# Altium project PROC114E3_SCH.PrjPcb (part 2 of 22)

## Sheet 10.SchDoc
size 513 x 386 mm
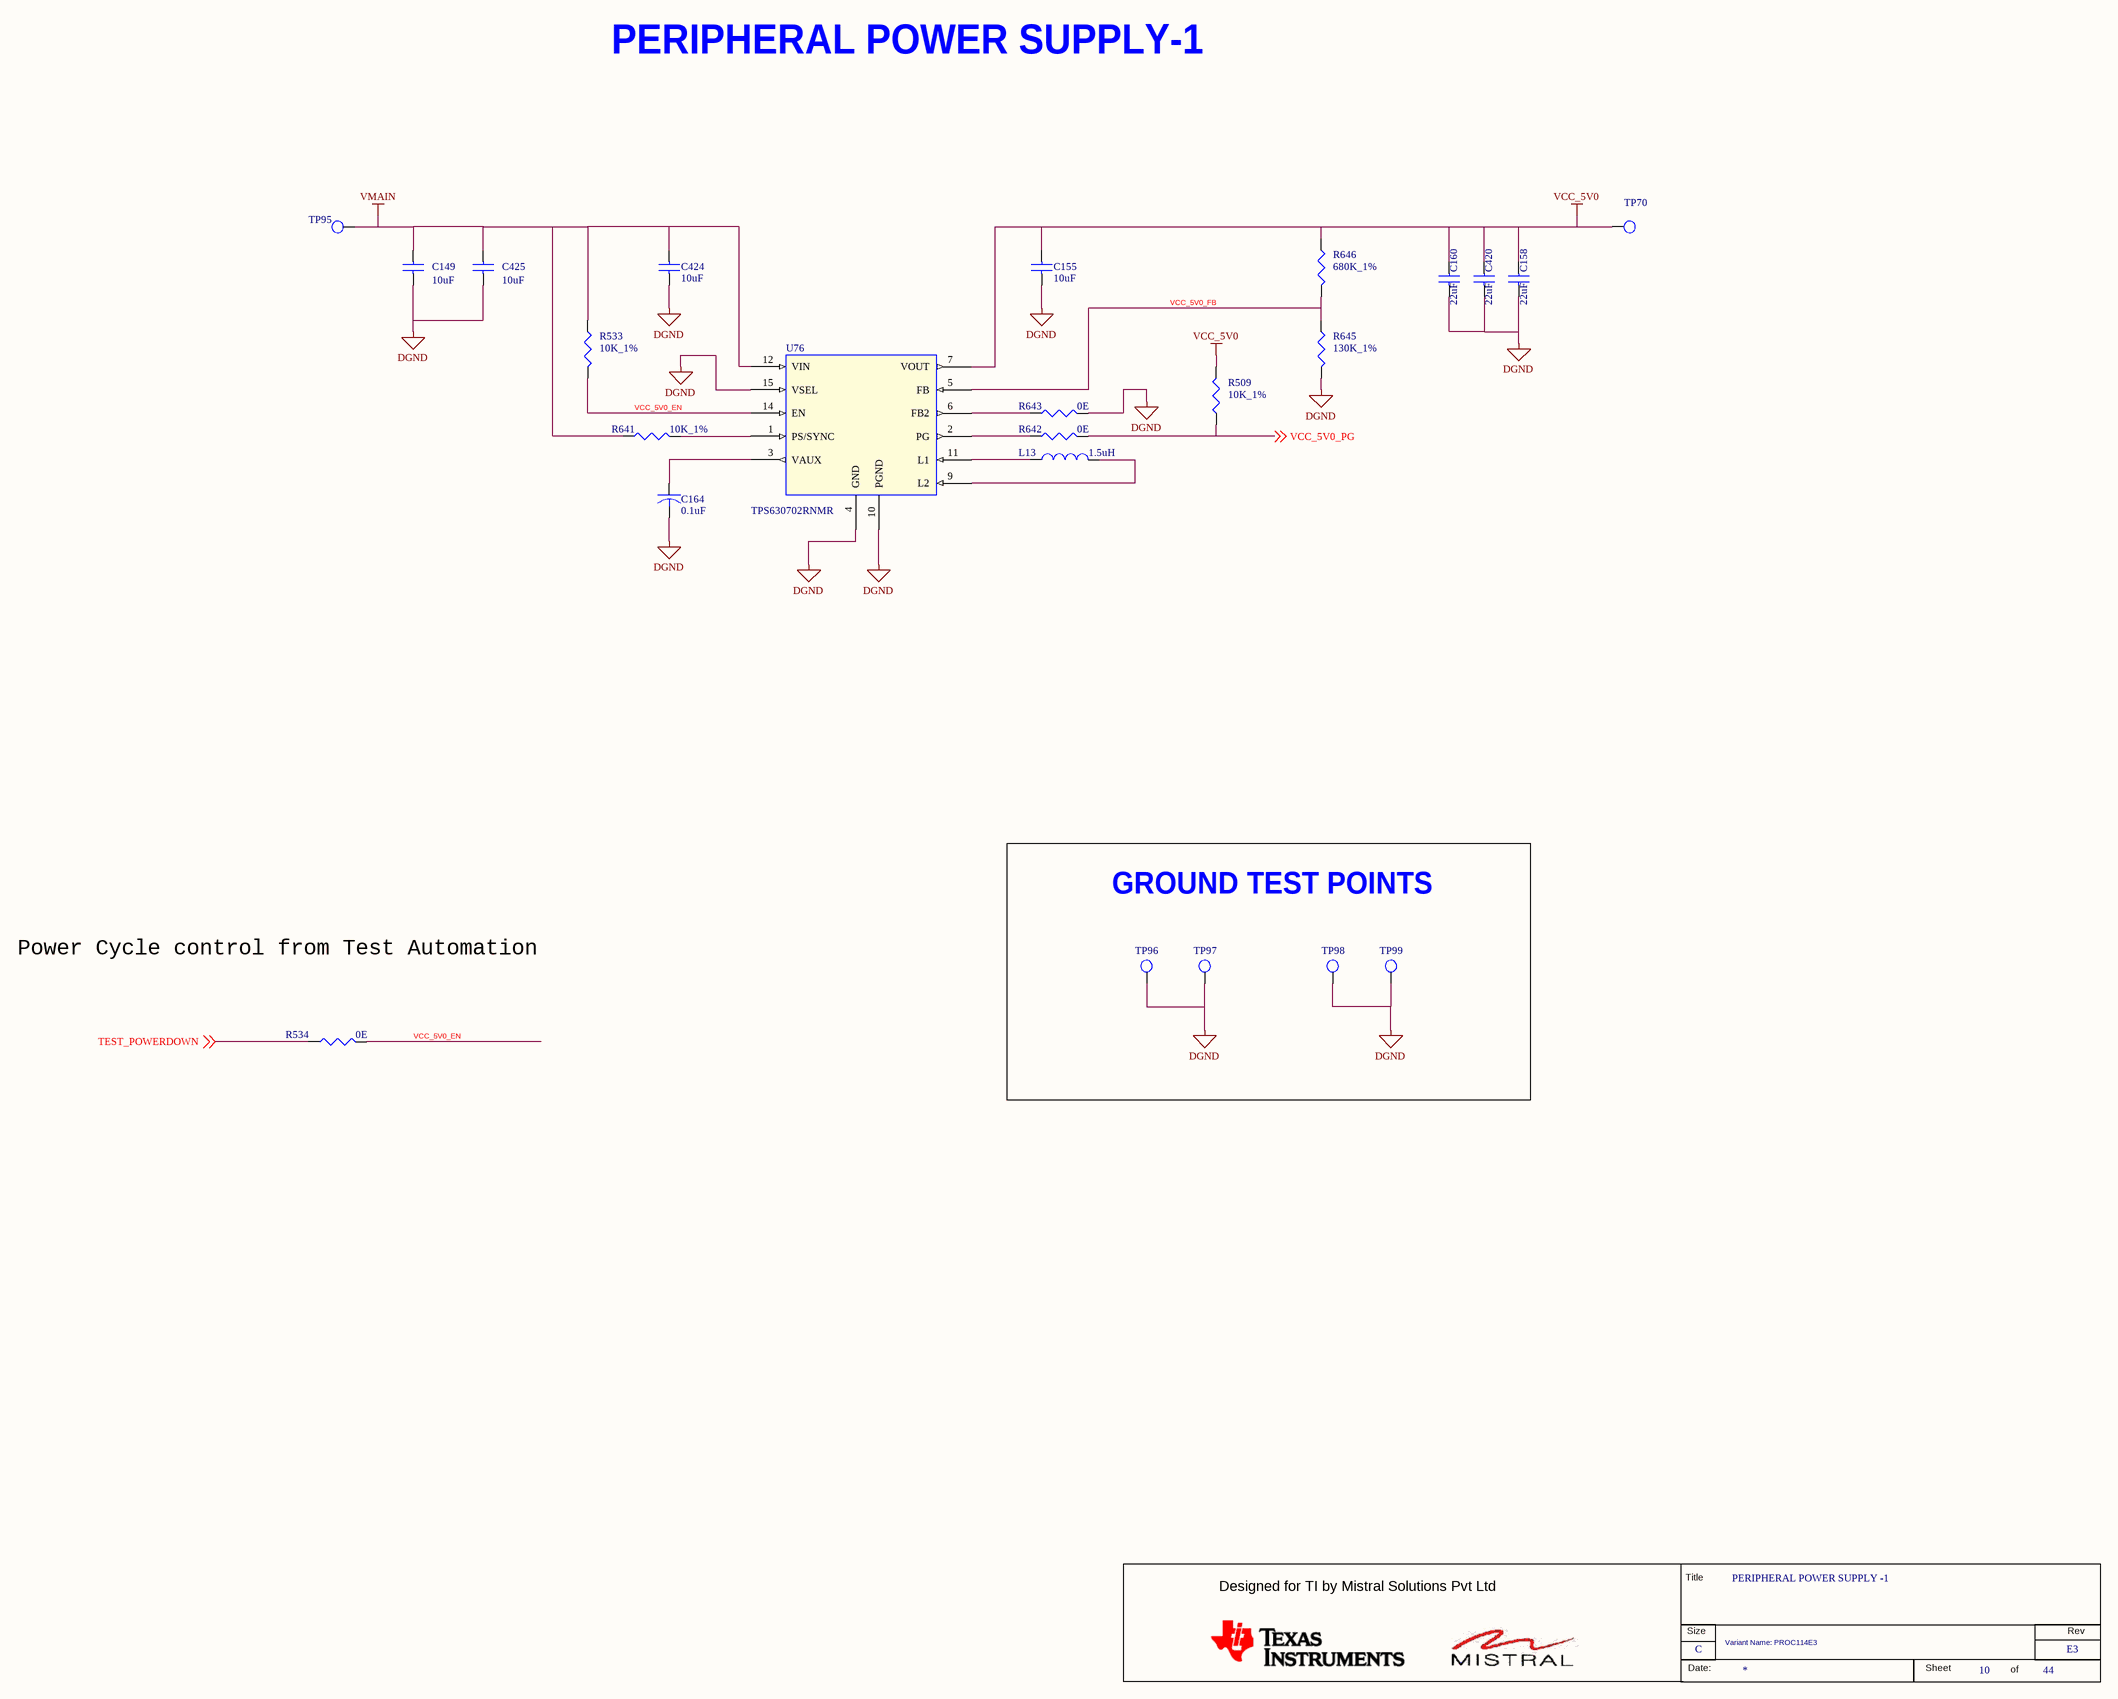
[diagram p10: 10.SchDoc]

### Parts
(Parts that share a designator on the sheet are numbered #1, #2 ... from top to bottom, then left to right.)
*#10  RevCode: E3  Title: PERIPHERAL POWER SUPPLY -1  Page Size: C  Page Number: 10  Page Count: 44  Variant Name: PROC114E3  (hidden comment: MISTRAL_TITLEBLK_CSIZE)  (graphical)
C149  10uF  [CAP0805_1-5]
C155  10uF  [CAP0603_1]
C158  22uF  [CAP0805_1-5]
C160  22uF  [CAP0805_1-5]
C164  0.1uF  [CAP0402_0-75]
C420  22uF  [CAP0805_1-5]
C424  10uF  [CAP0603_1]
C425  10uF  [CAP0805_1-5]
L13  1.5uH  [IND_XFL4020_170X170_SMD_2-1]
R509  10K_1%  [RES0201_0-5]
R533  10K_1%  [RES0201_0-5]
R534  0E  [RES0201_0-5]
R641  10K_1%  [RES0201_0-5]
R642  0E  [RES0201_0-5]
R643  0E  [RES0201_0-5]
R645  130K_1%  [RES0402_0-5]
R646  680K_1%  [RES0402_0-5]
TP70  TP20_SMD  [TP20_SMD]  (value not drawn)
TP95  TP20_SMD  [TP20_SMD]  (value not drawn)
TP96  THRU HOLE  [TP_36X22]  (value not drawn)
TP97  THRU HOLE  [TP_36X22]  (value not drawn)
TP98  TP20_SMD  [TP20_SMD]  (value not drawn)
TP99  TP20_SMD  [TP20_SMD]  (value not drawn)
U76  TPS630702RNMR  [VQFNHR15_TPS630701_100X120_1]

### Blocks framed on the sheet
GROUND TEST POINTS: TP96-TP99

### Nets
DGND: C149.2 C155.2 C158.2 C160.2 C164.2 C420.2 C424.2 C425.2 R643.2 R645.2 TP96.1(TP) TP97.1(TP) TP98.1(TP) TP99.1(TP) U76.4(GND) U76.10(PGND) U76.15(VSEL)
VCC_5V0: C155.1 C158.1 C160.1 C420.1 R509.2 R646.1 TP70.1(TP) U76.7(VOUT)
VMAIN: C149.1 C424.1 C425.1 R533.1 R641.1 TP95.1(TP) U76.12(VIN)
TEST_POWERDOWN: R534.1 ; off-sheet TEST_POWERDOWN
VCC_5V0_EN: R533.2 R534.2 U76.14(EN)
VCC_5V0_FB: R645.1 R646.2 U76.5(FB)
VCC_5V0_PG: R509.1 R642.2 ; off-sheet VCC_5V0_PG
NetC164_1: C164.1 U76.3(VAUX)
NetL13_1: L13.1 U76.11(L1)
NetL13_2: L13.2 U76.9(L2)
NetR641_2: R641.2 U76.1(PS/SYNC)
NetR642_1: R642.1 U76.2(PG)
NetR643_1: R643.1 U76.6(FB2)

### Notes on the sheet
- PERIPHERAL POWER SUPPLY-1
- Power Cycle control from Test Automation
- (in symbol MISTRAL_TITLEBLK_CSIZE) Title; Designed for TI by Mistral Solutions Pvt Ltd; Size; Rev; Date:; Sheet; of

### Library data of the parts
*#10 = MISTRAL_TITLEBLK_CSIZE: Issue: 1.0; Page Create Date: March  8, 1995; Page Modify Date: *; Schematic Page Count: 44; Schematic Page Number: 10
C149 = CAP_Dup2: CAP CERAMIC 10uF 50V 10% X5R 0805; Mistral Part No: 120021030002-R; Mfr_name: MURATA; Mfr_part_number: GRM21BR61H106KE43L; Part_type: CAPACITORS\CERAMIC; Project: J7ES_SK_BRD; Wattage: NA; Customs_HS_Code: 85322990; Custom_Duty: 15%; Footprint Ref: CAP0805_1-5; Tolerance: 10%; Voltage: 50V; Package: 0805; Distributor_name: DIGIKEY; Distributor_part_number: 490-18663-1-ND; Library Ref: CAP; Height: 1.45MM; Weight: 6.4mg; Temperature: -55°C+85°C; Datasheet: Y:\MIS_DATABASE\DATASHEETS\CAPACITORS\GRM21BR61H106KE43.PDF; Crtd /date: ALVY/010321; Chkd/date: MANIRAJA/010321; MECHANICAL 3D STEP FILE: CAP0805_1-5; Library Path: Y:\MIS_DATABASE\Library\ALTIUM_TOOL\SCHEMATICS_PARTS\MS_DISCRETE_Library.schlib; Footprint Path: Y:\MIS_DATABASE\Library\ALTIUM_TOOL\PCB_FOOTPRINTS\Altium_Footprint_Lib.PcbLib; PCB Footprint: CAP0805_1-5
C155 = CAP_Dup2: as C150 on sheet 09; Footprint Ref: CAP0603_1; Tolerance: 20%; Voltage: 35V; Package: 0603; Distributor_name: DIGIKEY; Distributor_part_number: 490-13248-1-ND; Library Ref: CAP; Height: 1.00MM; Weight: 9mg; Temperature: -55°C+85°C; Datasheet: Y:\MIS_DATABASE\DATASHEETS\CAPACITORS\GRM188R6YA106MA73.PDF; Crtd /date: ALVY/160519; Chkd/date: MANIRAJA/170519; MECHANICAL 3D STEP FILE: CAP0603_1; Library Path: Y:\MIS_DATABASE\Library\ALTIUM_TOOL\SCHEMATICS_PARTS\MS_DISCRETE_Library.schlib; Footprint Path: Y:\MIS_DATABASE\Library\ALTIUM_TOOL\PCB_FOOTPRINTS\Altium_Footprint_Lib.PcbLib; PCB Footprint: CAP0603_1
C158 C160 = CAP_Dup2: CAP CERAMIC 22uF 25V 20% X5R 0805; Part_type: CAPACITORS\CERAMIC; Mfr_part_number: GRM21BR61E226ME44K; Mfr_name: MURATA; Mistral Part No: 120013120018-R; Custom_Duty: 15%; Customs_HS_Code: 85322990; Wattage: NA; Project: TI_J7SVB_PCIE_ADD-ON-CARD; PCB Footprint: CAP0805_1-5; Footprint Path: Y:\MIS_DATABASE\Library\ALTIUM_TOOL\PCB_FOOTPRINTS\Altium_Footprint_Lib.PcbLib; Library Path: Y:\MIS_DATABASE\Library\ALTIUM_TOOL\SCHEMATICS_PARTS\MS_DISCRETE_Library.schlib; MECHANICAL 3D STEP FILE: CAP0805_1-5; Chkd/date: MANIRAJA/110718; Crtd /date: ALVY/110718; Datasheet: Y:\MIS_DATABASE\DATASHEETS\CAPACITORS\GRM21BR61E226ME44K.PDF; Temperature: -55°C+85°C; Weight: 9.5mg; Height: 1.45MM; Library Ref: CAP; Distributor_part_number: 490-14661-1-ND; Distributor_name: DIGIKEY; Package: 0805; Voltage: 25V; Tolerance: 20%; Footprint Ref: CAP0805_1-5
C164 = CAP_Dup1: CAP CERAMIC 0.1uF 50V 10% X7R 0402; Part_type: CAPACITORS\CERAMIC; Mfr_part_number: GRM155R71H104KE14D; Mfr_name: MURATA; Mistral Part No: 120011100014-R; Custom_Duty: 15%; Customs_HS_Code: 85322990; Wattage: NA; Project: J7_CP; Footprint Path: Y:\MIS_DATABASE\Library\ALTIUM_TOOL\PCB_FOOTPRINTS\Altium_Footprint_Lib.PcbLib; Library Path: Y:\MIS_DATABASE\Library\ALTIUM_TOOL\SCHEMATICS_PARTS\MS_DISCRETE_Library.schlib; MECHANICAL 3D STEP FILE: CAP0402_0-75; Chkd/date: MANIRAJA/261020; Crtd /date: ALVY/211020; Datasheet: Y:\MIS_DATABASE\DATASHEETS\CAPACITORS\GRM155R71H104KE14.PDF; Temperature: -55°C+125°C; Weight: 3.1mg; Height: 0.55MM; Library Ref: CAP; Distributor_part_number: 490-10700-1-ND; Distributor_name: DIGIKEY; Package: 0402; Voltage: 50V; Tolerance: 10%; Footprint Ref: CAP0402_0-75; PCB Footprint: CAP0402_0-75
C420 = CAP_Dup2: CAP CERAMIC 22uF 25V 20% X5R 0805; Mistral Part No: 120013120018-R; Mfr_name: MURATA; Mfr_part_number: GRM21BR61E226ME44K; Part_type: CAPACITORS\CERAMIC; Project: TI_J7SVB_PCIE_ADD-ON-CARD; Wattage: NA; Customs_HS_Code: 85322990; Custom_Duty: 15%; PCB Footprint: CAP0805_1-5; Footprint Ref: CAP0805_1-5; Tolerance: 20%; Voltage: 25V; Package: 0805; Distributor_name: DIGIKEY; Distributor_part_number: 490-14661-1-ND; Library Ref: CAP; Height: 1.45MM; Weight: 9.5mg; Temperature: -55°C+85°C; Datasheet: Y:\MIS_DATABASE\DATASHEETS\CAPACITORS\GRM21BR61E226ME44K.PDF; Crtd /date: ALVY/110718; Chkd/date: MANIRAJA/110718; MECHANICAL 3D STEP FILE: CAP0805_1-5; Library Path: Y:\MIS_DATABASE\Library\ALTIUM_TOOL\SCHEMATICS_PARTS\MS_DISCRETE_Library.schlib; Footprint Path: Y:\MIS_DATABASE\Library\ALTIUM_TOOL\PCB_FOOTPRINTS\Altium_Footprint_Lib.PcbLib
C424 = CAP_Dup2: as C141 on sheet 09; Footprint Path: Y:\MIS_DATABASE\Library\ALTIUM_TOOL\PCB_FOOTPRINTS\Altium_Footprint_Lib.PcbLib; Library Path: Y:\MIS_DATABASE\Library\ALTIUM_TOOL\SCHEMATICS_PARTS\MS_DISCRETE_Library.schlib; MECHANICAL 3D STEP FILE: CAP0603_1; Chkd/date: MANIRAJA/170519; Crtd /date: ALVY/160519; Datasheet: Y:\MIS_DATABASE\DATASHEETS\CAPACITORS\GRM188R6YA106MA73.PDF; Temperature: -55°C+85°C; Weight: 9mg; Height: 1.00MM; Library Ref: CAP; Distributor_part_number: 490-13248-1-ND; Distributor_name: DIGIKEY; Package: 0603; Voltage: 35V; Tolerance: 20%; Footprint Ref: CAP0603_1; PCB Footprint: CAP0603_1
C425 = CAP_Dup2: CAP CERAMIC 10uF 50V 10% X5R 0805; Part_type: CAPACITORS\CERAMIC; Mfr_part_number: GRM21BR61H106KE43L; Mfr_name: MURATA; Mistral Part No: 120021030002-R; Custom_Duty: 15%; Customs_HS_Code: 85322990; Wattage: NA; Project: J7ES_SK_BRD; Footprint Path: Y:\MIS_DATABASE\Library\ALTIUM_TOOL\PCB_FOOTPRINTS\Altium_Footprint_Lib.PcbLib; Library Path: Y:\MIS_DATABASE\Library\ALTIUM_TOOL\SCHEMATICS_PARTS\MS_DISCRETE_Library.schlib; MECHANICAL 3D STEP FILE: CAP0805_1-5; Chkd/date: MANIRAJA/010321; Crtd /date: ALVY/010321; Datasheet: Y:\MIS_DATABASE\DATASHEETS\CAPACITORS\GRM21BR61H106KE43.PDF; Temperature: -55°C+85°C; Weight: 6.4mg; Height: 1.45MM; Library Ref: CAP; Distributor_part_number: 490-18663-1-ND; Distributor_name: DIGIKEY; Package: 0805; Voltage: 50V; Tolerance: 10%; Footprint Ref: CAP0805_1-5; PCB Footprint: CAP0805_1-5
L13 = INDUCTOR_Dup1: IND POWER 1.5uH 9.1A 20% SMD; Mistral Part No: 130019100011-R; Mfr_name: COIL CRAFT; Mfr_part_number: XFL4020-152MEB; Project: NPOL_UAIS_CONTROLLER-CARD; Voltage: NA; Customs_HS_Code: 85437099; Custom_Duty: 24%; Footprint Ref: IND_XFL4020_170X170_SMD_2-1; Part_type: INDUCTOR; Tolerance: 20%; Wattage: NA; Package: SMD; Distributor_name: MOUSER; Distributor_part_number: 994-XFL4020-152MEB; Library Ref: INDUCTOR; Height: 2.10MM; Weight: 169mg; Temperature: -40°C+125°C; Datasheet: Y:\MIS_DATABASE\DATASHEETS\DISCRETES\INDUCTORS\XFL4020.PDF; Crtd /date: MANIRAJA/101019; Chkd/date: MANIRAJA/101019; MECHANICAL 3D STEP FILE: IND_XFL4020_170X170_SMD_2-1; Library Path: Y:\MIS_DATABASE\Library\ALTIUM_TOOL\SCHEMATICS_PARTS\MS_DISCRETE_Library.schlib; Footprint Path: Y:\MIS_DATABASE\Library\ALTIUM_TOOL\PCB_FOOTPRINTS\Altium_Footprint_Lib.PcbLib; PCB Footprint: IND_XFL4020_170X170_SMD_2-1
R509 R533 R641 = RESISTOR_Dup6: as R470 on sheet 09; PCB Footprint: RES0201_0-5; Footprint Ref: RES0201_0-5; Tolerance: 1%; Wattage: 1/20W; Package: 0201; Distributor_name: DIGIKEY; Distributor_part_number: 311-10.0KMCT-ND; Library Ref: RESISTOR; Height: 0.26MM; Weight: 0.17mg; Temperature: -55°C+125°C; Datasheet: Y:\MIS_DATABASE\DATASHEETS\RESISTORS\RCXXXXL-SER_MAR18.PDF; Crtd /date: MANIRAJA/270117; Chkd/date: VASANTHA/270117; MECHANICAL 3D STEP FILE: RES0201_0-5; Library Path: Y:\MIS_DATABASE\Library\ALTIUM_TOOL\SCHEMATICS_PARTS\MS_DISCRETE_Library.schlib; Footprint Path: Y:\MIS_DATABASE\Library\ALTIUM_TOOL\PCB_FOOTPRINTS\Altium_Footprint_Lib.PcbLib
R534 R642 = RESISTOR_Dup6: as R157 on sheet 09; PCB Footprint: RES0201_0-5; Footprint Path: Y:\MIS_DATABASE\Library\ALTIUM_TOOL\PCB_FOOTPRINTS\Altium_Footprint_Lib.PcbLib; Library Path: Y:\MIS_DATABASE\Library\ALTIUM_TOOL\SCHEMATICS_PARTS\MS_DISCRETE_Library.schlib; MECHANICAL 3D STEP FILE: RES0201_0-5; Chkd/date: NAVEED/301214; Crtd /date: MUDDU/120710; Datasheet: Y:\MIS_DATABASE\DATASHEETS\RESISTORS\RCXXXXL-SER_MAR18.PDF; Temperature: -55°C+125°C; Weight: 0.17mg; Height: 0.26MM; Library Ref: RESISTOR; Distributor_part_number: 311-0.0NCT-ND; Distributor_name: DIGIKEY; Package: 0201; Wattage: 1/20W; Tolerance: 5%; Footprint Ref: RES0201_0-5
R643 = RESISTOR_Dup6: as R468 on sheet 09; PCB Footprint: RES0201_0-5; Footprint Ref: RES0201_0-5; Tolerance: 5%; Wattage: 1/20W; Package: 0201; Distributor_name: DIGIKEY; Distributor_part_number: 311-0.0NCT-ND; Library Ref: RESISTOR; Height: 0.26MM; Weight: 0.17mg; Temperature: -55°C+125°C; Datasheet: Y:\MIS_DATABASE\DATASHEETS\RESISTORS\RCXXXXL-SER_MAR18.PDF; Crtd /date: MUDDU/120710; Chkd/date: NAVEED/301214; MECHANICAL 3D STEP FILE: RES0201_0-5; Library Path: Y:\MIS_DATABASE\Library\ALTIUM_TOOL\SCHEMATICS_PARTS\MS_DISCRETE_Library.schlib; Footprint Path: Y:\MIS_DATABASE\Library\ALTIUM_TOOL\PCB_FOOTPRINTS\Altium_Footprint_Lib.PcbLib
R645 = RESISTOR_Dup6: RES 130K 1/10W 1% 0402; Part_type: RESISTORS\FIXED; Mfr_part_number: ERJ-2RKF1303X; Mfr_name: PANASONIC-ECG; Mistral Part No: 110011060012-R; Custom_Duty: 15%; Customs_HS_Code: 85332119; Voltage: NA; Project: AM4515_EVM_LCD; PCB Footprint: RES0402_0-5; Footprint Path: Y:\MIS_DATABASE\Library\ALTIUM_TOOL\PCB_FOOTPRINTS\Altium_Footprint_Lib.PcbLib; Library Path: Y:\MIS_DATABASE\Library\ALTIUM_TOOL\SCHEMATICS_PARTS\MS_DISCRETE_Library.schlib; MECHANICAL 3D STEP FILE: RES0402_0-5; Chkd/date: MAZHAR/150611; Crtd /date: BAVISH/020611; Datasheet: Y:\MIS_DATABASE\DATASHEETS\RESISTORS\PAN-ERJSER_NOV17.PDF; Temperature: -55°C+155°C; Weight: 0.8mg; Height: 0.40MM; Library Ref: RESISTOR; Distributor_part_number: P130KLCT-ND; Distributor_name: DIGIKEY; Package: 0402; Wattage: 1/10W; Tolerance: 1%; Footprint Ref: RES0402_0-5
R646 = RESISTOR_Dup6: RES 680K 1/10W 1% 0402; Mistral Part No: 110011040004-R; Mfr_name: PANASONIC-ECG; Mfr_part_number: ERJ-2RKF6803X; Part_type: RESISTORS\FIXED; Project: AM4515_EVM_LCD; Voltage: NA; Customs_HS_Code: 85332119; Custom_Duty: 15%; PCB Footprint: RES0402_0-5; Footprint Ref: RES0402_0-5; Tolerance: 1%; Wattage: 1/10W; Package: 0402; Distributor_name: DIGIKEY; Distributor_part_number: P680KLCT-ND; Library Ref: RESISTOR; Height: 0.40MM; Weight: 0.8mg; Temperature: -55°C+155°C; Datasheet: Y:\MIS_DATABASE\DATASHEETS\RESISTORS\PAN-ERJSER_NOV17.PDF; Crtd /date: MAZHAR/180411; Chkd/date: SUHAS/200411; MECHANICAL 3D STEP FILE: RES0402_0-5; Library Path: Y:\MIS_DATABASE\Library\ALTIUM_TOOL\SCHEMATICS_PARTS\MS_DISCRETE_Library.schlib; Footprint Path: Y:\MIS_DATABASE\Library\ALTIUM_TOOL\PCB_FOOTPRINTS\Altium_Footprint_Lib.PcbLib
TP70 TP99 = TESTPOINT: TESTPOINT CIR 20 SMD; Mfr_name: LOCAL; Custom_Duty: NA; Project: BT MODULE_CSRBC04; PCB Footprint: TP20_SMD; Customs_HS_Code: NA; RoHS: NA; Footprint Ref: TP20_SMD; Library Ref: TESTPOINT; Mistral Part No: NA; Mfr_part_number: TP20_SMD; Part_type: TESTPOINT; Package: SMD; Distributor_name: NA; Distributor_part_number: NA; Height: NA; Crtd /date: MAZHAR/171006; Chkd/date: SHREESHAIL/171006; Tolerance: NA; Voltage: NA; Wattage: NA; Weight: NA; Temperature: NA; Datasheet: NA; MECHANICAL 3D STEP FILE: NA; Library Path: Y:\MIS_DATABASE\Library\ALTIUM_TOOL\SCHEMATICS_PARTS\MS_DISCRETE_Library.schlib; Footprint Path: Y:\MIS_DATABASE\Library\ALTIUM_TOOL\PCB_FOOTPRINTS\Altium_Footprint_Lib.PcbLib
TP95 = TESTPOINT: as TP92 on sheet 09; Footprint Path: Y:\MIS_DATABASE\Library\ALTIUM_TOOL\PCB_FOOTPRINTS\Altium_Footprint_Lib.PcbLib; Library Path: Y:\MIS_DATABASE\Library\ALTIUM_TOOL\SCHEMATICS_PARTS\MS_DISCRETE_Library.schlib; Datasheet: NA; Temperature: NA; Weight: NA; Wattage: NA; Voltage: NA; Tolerance: NA; Chkd/date: SHREESHAIL/171006; Crtd /date: MAZHAR/171006; Height: NA; Distributor_part_number: NA; Distributor_name: NA; Package: SMD; Part_type: TESTPOINT; Mfr_part_number: TP20_SMD; Mistral Part No: NA; Library Ref: TESTPOINT; Footprint Ref: TP20_SMD; RoHS: NA; Customs_HS_Code: NA; Custom_Duty: NA; PCB Footprint: TP20_SMD
TP96 = TESTPOINT: TESTPOINT 0.56MM DRILL PTH; Mfr_name: LOCAL; Mistral Part No: 130010010008; Project: KOPIN_MODULS; Tolerance: NA; PCB Footprint: TP_36X22; Library Ref: TESTPOINT; Datasheet: NA; Chkd/date: BAVISH/040311; Crtd /date: MAZHAR/110405; Height: NA; Distributor_part_number: NA; Distributor_name: NA; Package: THRU-HOLE; Part_type: TESTPOINT; Mfr_part_number: TP_36X22; Voltage: NA; Wattage: NA; Weight: NA; Temperature: NA
TP97 = TESTPOINT: TESTPOINT 0.56MM DRILL PTH; Mistral Part No: 130010010008; Mfr_name: LOCAL; Wattage: NA; Project: KOPIN_MODULS; PCB Footprint: TP_36X22; Temperature: NA; Weight: NA; Voltage: NA; Tolerance: NA; Mfr_part_number: TP_36X22; Part_type: TESTPOINT; Package: THRU-HOLE; Distributor_name: NA; Distributor_part_number: NA; Height: NA; Crtd /date: MAZHAR/110405; Chkd/date: BAVISH/040311; Datasheet: NA; Library Ref: TESTPOINT
TP98 = TESTPOINT: TESTPOINT CIR 20 SMD; Mistral Part No: NA; Mfr_name: LOCAL; Project: BT MODULE_CSRBC04; PCB Footprint: TP20_SMD; RoHS: NA; Footprint Ref: TP20_SMD; Library Ref: TESTPOINT; Mfr_part_number: TP20_SMD; Part_type: TESTPOINT; Package: SMD; Distributor_name: NA; Distributor_part_number: NA; Height: NA; Crtd /date: MAZHAR/171006; Chkd/date: SHREESHAIL/171006; Tolerance: NA; Voltage: NA; Wattage: NA; Weight: NA; Temperature: NA; Datasheet: NA; MECHANICAL 3D STEP FILE: NA; Library Path: Y:\MIS_DATABASE\Library\ALTIUM_TOOL\SCHEMATICS_PARTS\MS_DISCRETE_Library.schlib; Footprint Path: Y:\MIS_DATABASE\Library\ALTIUM_TOOL\PCB_FOOTPRINTS\Altium_Footprint_Lib.PcbLib; Customs_HS_Code: NA; Custom_Duty: NA
U76 = TPS630701_VQFN-HR15: IC ADJ BUCK-BOOST CONVERTER WITH 3.6A SWITCH CURRENT VQFN-HR15; Mistral Part No: 142022010015-R; Mfr_name: TEXAS INSTRUMENTS; Part_type: ICS\POWER\DC-DC CONVERTER; Project: AM62X_SKEVM; Tolerance: NA; Customs_HS_Code: 85423100; Custom_Duty: 15%; PCB Footprint: VQFNHR15_TPS630701_100X120_1; Footprint Ref: VQFNHR15_TPS630701_100X120_1; Mfr_part_number: TPS630702RNMR; Voltage: NA; Wattage: NA; Package: VQFN-HR15; Distributor_name: DIGIKEY; Distributor_part_number: 296-TPS630702RNMRCT-ND; Library Ref: TPS630701_VQFN-HR15; Height: 1.00MM; Weight: 17.7mg; Temperature: -40°C+125°C; Datasheet: Y:\MIS_DATABASE\DATASHEETS\ICS\POWER\TPS630701X.PDF; Crtd /date: MANIRAJA/250122; Chkd/date: ALVY/250122; MECHANICAL 3D STEP FILE: VQFNHR15_TPS630701_100X120_1; Library Path: Y:\MIS_DATABASE\Library\ALTIUM_TOOL\SCHEMATICS_PARTS\MS_MISCPOWER_Library.schlib; Footprint Path: Y:\MIS_DATABASE\Library\ALTIUM_TOOL\PCB_FOOTPRINTS\Altium_Footprint_Lib.PcbLib

## Sheet 11.SchDoc
size 513 x 386 mm
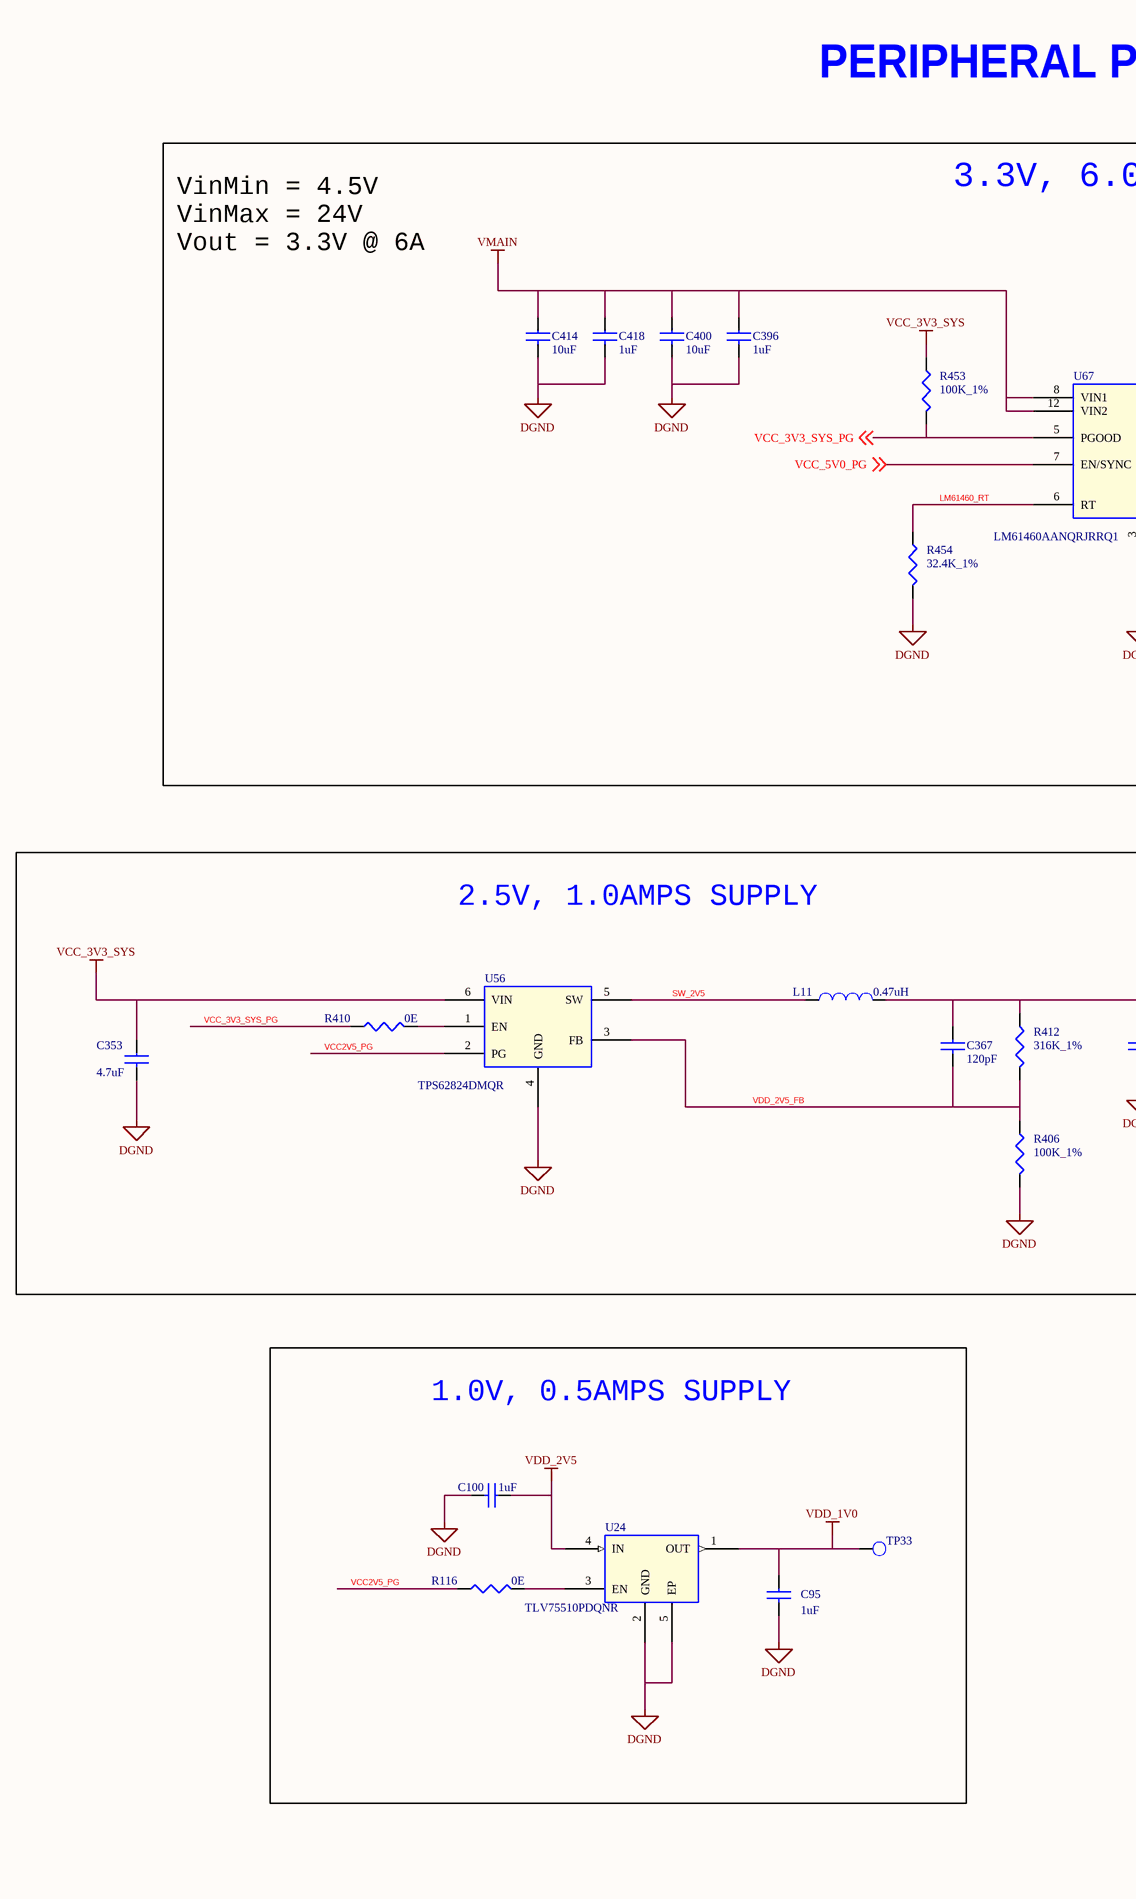
[diagram p11: 11.SchDoc, left]
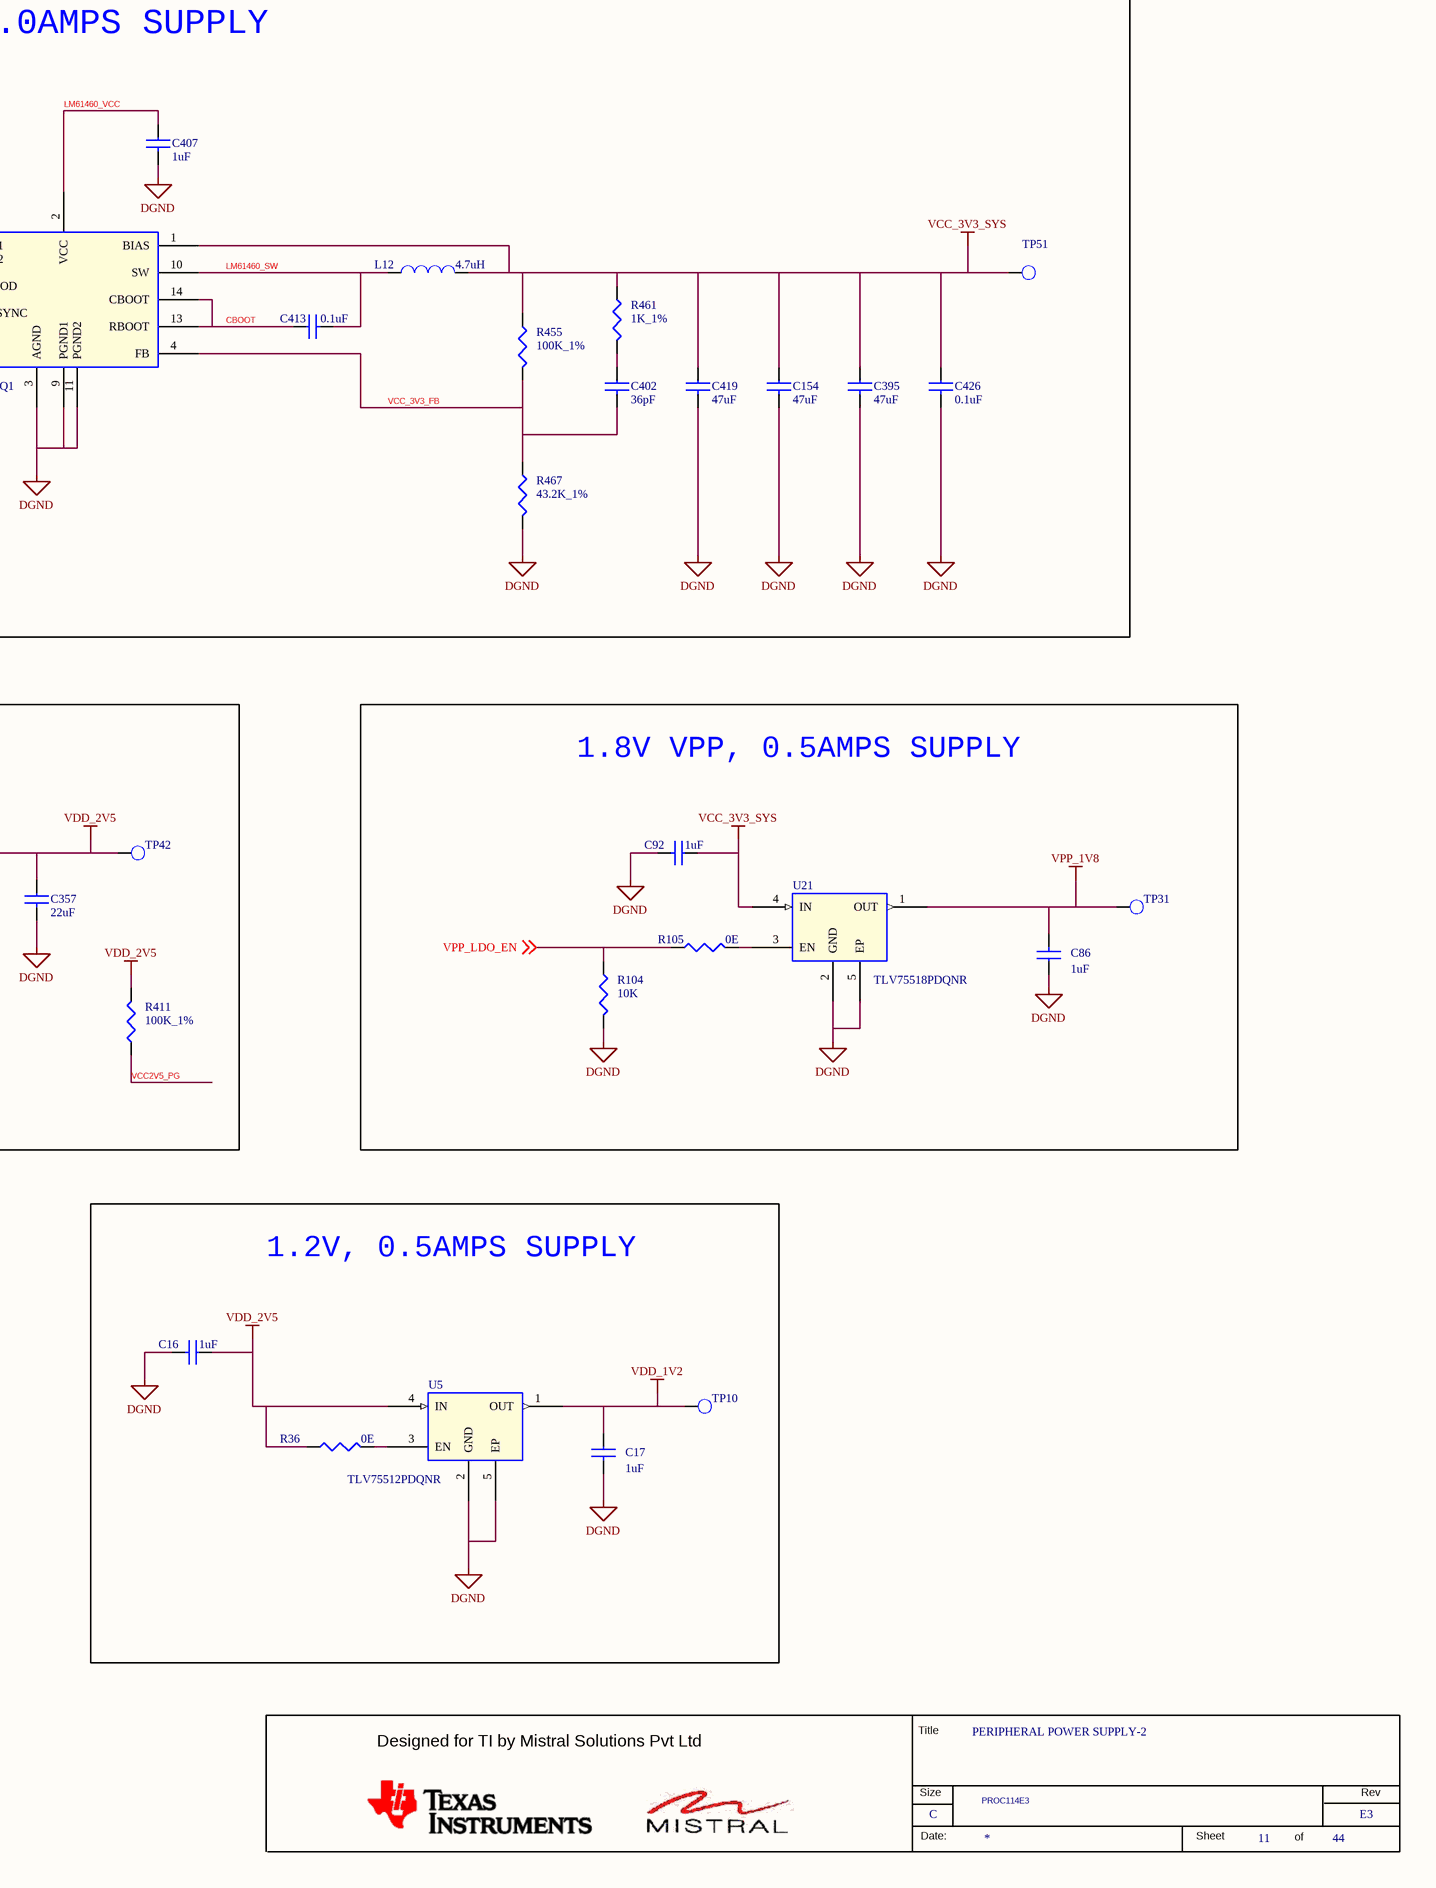
[diagram p12: 11.SchDoc, right]

### Parts
(Parts that share a designator on the sheet are numbered #1, #2 ... from top to bottom, then left to right.)
*#11  RevCode: E3  Title: PERIPHERAL POWER SUPPLY-2  Page Size: C  Page Number: 11  Page Count: 44  Variant Name: PROC114E3  (hidden comment: MISTRAL_TITLEBLK_CSIZE)  (graphical)
C16  1uF  [CAP0201_0-5]
C17  1uF  [CAP0201_0-5]
C86  1uF  [CAP0201_0-5]
C92  1uF  [CAP0201_0-5]
C95  1uF  [CAP0201_0-5]
C100  1uF  [CAP0201_0-5]
C154  47uF  [CAP1210_2-75]
C353  4.7uF  [CAP0603_1]
C357  22uF  [CAP0603_1]
C367  120pF  [CAP0201_0-5]
C395  47uF  [CAP1210_2-75]
C396  1uF  [CAP0805_1-5]
C400  10uF  [CAP0603_1]
C402  36pF  [CAP0402_0-75]
C407  1uF  [CAP0201_0-5]
C413  0.1uF  [CAP0402_0-75]
C414  10uF  [CAP0603_1]
C418  1uF  [CAP0805_1-5]
C419  47uF  [CAP1210_2-75]
C426  0.1uF  [CAP0402_0-75]
L11  0.47uH  [IND0806_1-2]
L12  4.7uH  [IND_XAL6060_260X270_SMD_6-1]
R36  0E  [RES0201_0-5]
R104  10K  [RES0201_0-5]
R105  0E  [RES0201_0-5]
R116  0E  [RES0201_0-5]
R406  100K_1%  [RES0402_0-5]
R410  0E  [RES0201_0-5]
R411  100K_1%  [RES0402_0-5]
R412  316K_1%  [RES0402_0-5]
R453  100K_1%  [RES0402_0-5]
R454  32.4K_1%  [RES0402_0-5]
R455  100K_1%  [RES0402_0-5]
R461  1K_1%  [RES0402_0-5]
R467  43.2K_1%  [RES0402_0-5]
TP10  TP20_SMD  [TP20_SMD]  (value not drawn)
TP31  TP20_SMD  [TP20_SMD]  (value not drawn)
TP33  TP20_SMD  [TP20_SMD]  (value not drawn)
TP42  TP20_SMD  [TP20_SMD]  (value not drawn)
TP51  TP20_SMD  [TP20_SMD]  (value not drawn)
U5  TLV75512PDQNR  [X2SON4_TLV71318P_40X40_0-4]
U21  TLV75518PDQNR  [X2SON4_TLV71318P_40X40_0-4]
U24  TLV75510PDQNR  [X2SON4_TLV71318P_40X40_0-4]
U56  TPS62824DMQR  [VSONHR6_TPS62826_60X60_1]
U67  LM61460AANQRJRRQ1  [VQFNHR14_LM61460_160X140_1]

### Blocks framed on the sheet
3.3V, 6.0AMPS SUPPLY: C154 C395 C396 C400 C402 C407 C413 C414 C418 C419 C426 L12 R453-R455 R461 R467 TP51 U67
2.5V, 1.0AMPS SUPPLY: C353 C357 C367 L11 R406 R410-R412 TP42 U56
1.8V VPP, 0.5AMPS SUPPLY: C86 C92 R104 R105 TP31 U21
1.0V, 0.5AMPS SUPPLY: C95 C100 R116 TP33 U24
1.2V, 0.5AMPS SUPPLY: C16 C17 R36 TP10 U5

### Nets
DGND: C16.2 C17.2 C86.1 C92.2 C95.2 C100.2 C154.2 C353.2 C357.2 C395.2 C396.2 C400.2 C407.2 C414.2 C418.2 C419.2 C426.2 R104.2 R406.2 R454.2 R467.2 U5.2(GND) U5.5(EP) U21.2(GND) U21.5(EP) U24.2(GND) U24.5(EP) U56.4(GND) U67.3(AGND) U67.9(PGND1) U67.11(PGND2)
VCC_3V3_SYS: C92.1 C154.1 C353.1 C395.1 C419.1 C426.1 L12.2 R453.1 R455.1 R461.1 TP51.1(TP) U21.4(IN) U56.6(VIN) U67.1(BIAS)
VDD_1V0: C95.1 TP33.1(TP) U24.1(OUT)
VDD_1V2: C17.1 TP10.1(TP) U5.1(OUT)
VDD_2V5: C16.1 C100.1 C357.1 C367.1 L11.2 R36.1 R411.2 R412.1 TP42.1(TP) U5.4(IN) U24.4(IN)
VMAIN: C396.1 C400.1 C414.1 C418.1 U67.8(VIN1) U67.12(VIN2)
VPP_1V8: C86.2 TP31.1(TP) U21.1(OUT)
CBOOT: C413.1 U67.13(RBOOT) U67.14(CBOOT)
LM61460_RT: R454.1 U67.6(RT)
LM61460_SW: C413.2 L12.1 U67.10(SW)
LM61460_VCC: C407.1 U67.2(VCC)
SW_2V5: L11.1 U56.5(SW)
VCC2V5_PG: R116.1 R411.1 U56.2(PG)
VCC_3V3_FB: C402.2 R455.2 R467.1 U67.4(FB)
VCC_3V3_SYS_PG: R410.1 R453.2 U67.5(PGOOD) ; off-sheet VCC_3V3_SYS_PG
VCC_5V0_PG: U67.7(EN/SYNC) ; off-sheet VCC_5V0_PG
VDD_2V5_FB: C367.2 R406.1 R412.2 U56.3(FB)
VPP_LDO_EN: R104.1 R105.1 ; off-sheet VPP_LDO_EN
NetC402_1: C402.1 R461.2
NetR36_2: R36.2 U5.3(EN)
NetR105_2: R105.2 U21.3(EN)
NetR116_2: R116.2 U24.3(EN)
NetR410_2: R410.2 U56.1(EN)

### Notes on the sheet
- PERIPHERAL POWER SUPPLY-2
- VinMin = 4.5V
  VinMax = 24V
  Vout = 3.3V @ 6A
- (in symbol MISTRAL_TITLEBLK_CSIZE) Title; Designed for TI by Mistral Solutions Pvt Ltd; Size; Rev; Date:; Sheet; of

### Library data of the parts
*#11 = MISTRAL_TITLEBLK_CSIZE: Issue: 1.0; Page Create Date: March  8, 1995; Page Modify Date: *; Schematic Page Count: 44; Schematic Page Number: 11
C16 C407 = CAP_Dup2: CAP CERAMIC 1uF 16V 20% X5R 0201; Mistral Part No: 120018090038-R; Mfr_name: MURATA; Mfr_part_number: GRM033R61C105ME15D; Part_type: CAPACITORS\CERAMIC; Project: QCS610_NANOSOM; Wattage: NA; Customs_HS_Code: 85322990; Custom_Duty: 15%; Library Ref: CAP; MECHANICAL 3D STEP FILE: CAP0201_0-5; Tolerance: 20%; Voltage: 16V; Package: 0201; Distributor_name: DIGIKEY; Distributor_part_number: 490-18654-1-ND; Height: 0.39MM; Weight: 0.33mg; Temperature: -55°C+85°C; Datasheet: Y:\MIS_DATABASE\DATASHEETS\CAPACITORS\GRM033R61C105ME15.PDF; Crtd /date: ALVY/260520; Chkd/date: MANIRAJA/300520; Footprint Ref: CAP0201_0-5; Library Path: Y:\MIS_DATABASE\Library\ALTIUM_TOOL\SCHEMATICS_PARTS\MS_DISCRETE_Library.schlib; Footprint Path: Y:\MIS_DATABASE\Library\ALTIUM_TOOL\PCB_FOOTPRINTS\Altium_Footprint_Lib.PcbLib; PCB Footprint: CAP0201_0-5
C17 C86 C92 C95 C100 = CAP_Dup2: CAP CERAMIC 1uF 16V 20% X5R 0201; Part_type: CAPACITORS\CERAMIC; Mfr_part_number: GRM033R61C105ME15D; Mfr_name: MURATA; Mistral Part No: 120018090038-R; Custom_Duty: 15%; Customs_HS_Code: 85322990; Wattage: NA; Project: QCS610_NANOSOM; Footprint Path: Y:\MIS_DATABASE\Library\ALTIUM_TOOL\PCB_FOOTPRINTS\Altium_Footprint_Lib.PcbLib; Library Path: Y:\MIS_DATABASE\Library\ALTIUM_TOOL\SCHEMATICS_PARTS\MS_DISCRETE_Library.schlib; Footprint Ref: CAP0201_0-5; Chkd/date: MANIRAJA/300520; Crtd /date: ALVY/260520; Datasheet: Y:\MIS_DATABASE\DATASHEETS\CAPACITORS\GRM033R61C105ME15.PDF; Temperature: -55°C+85°C; Weight: 0.33mg; Height: 0.39MM; Distributor_part_number: 490-18654-1-ND; Distributor_name: DIGIKEY; Package: 0201; Voltage: 16V; Tolerance: 20%; MECHANICAL 3D STEP FILE: CAP0201_0-5; Library Ref: CAP; PCB Footprint: CAP0201_0-5
C154 C419 = CAP_Dup2: CAP CERAMIC 47uF 16V 10% X6S 1210; Mistral Part No: 120021070001-R; Mfr_name: MURATA; Mfr_part_number: GRM32EC81C476KE15L; Part_type: CAPACITORS\CERAMIC; Project: TI_AM263X_CC; Wattage: NA; Customs_HS_Code: 85322990; Custom_Duty: 15%; Footprint Ref: CAP1210_2-75; Tolerance: 10%; Voltage: 16V; Package: 1210; Distributor_name: DIGIKEY; Distributor_part_number: 490-10531-1-ND; Library Ref: CAP; Height: 2.70MM; Weight: 100mg; Temperature: -55°C+105°C; Datasheet: Y:\MIS_DATABASE\DATASHEETS\CAPACITORS\GRM32EC81C476KE15.PDF; Crtd /date: MANIRAJA/010721; Chkd/date: ALVY/010721; MECHANICAL 3D STEP FILE: CAP1210_2-75; Library Path: Y:\MIS_DATABASE\Library\ALTIUM_TOOL\SCHEMATICS_PARTS\MS_DISCRETE_Library.schlib; Footprint Path: Y:\MIS_DATABASE\Library\ALTIUM_TOOL\PCB_FOOTPRINTS\Altium_Footprint_Lib.PcbLib; PCB Footprint: CAP1210_2-75
C353 = CAP_Dup2: CAP CERAMIC 4.7uF 35V 20% X5R 0603; Mistral Part No: 120020050017-R; Mfr_name: MURATA; Mfr_part_number: GRM188R6YA475ME15D; Part_type: CAPACITORS\CERAMIC; Project: SD865_NANOSOM; Wattage: NA; Customs_HS_Code: 85322990; Custom_Duty: 15%; PCB Footprint: CAP0603_1; Footprint Path: Y:\MIS_DATABASE\Library\ALTIUM_TOOL\PCB_FOOTPRINTS\Altium_Footprint_Lib.PcbLib; Library Path: Y:\MIS_DATABASE\Library\ALTIUM_TOOL\SCHEMATICS_PARTS\MS_DISCRETE_Library.schlib; Footprint Ref: CAP0603_1; Library Ref: CAP; Tolerance: 20%; Voltage: 35V; Package: 0603; Distributor_name: DIGIKEY; Distributor_part_number: 490-11995-1-ND; Height: 1.00MM; Weight: 6.3mg; Temperature: -55°C+85°C; Datasheet: Y:\MIS_DATABASE\DATASHEETS\CAPACITORS\GRM188R6YA475ME15.PDF; Crtd /date: ALVY/120520; Chkd/date: MANIRAJA/120520; MECHANICAL 3D STEP FILE: CAP0603_1
C357 = CAP_Dup2: CAP CERAMIC 22uF 10V 20% X5R 0603; Mistral Part No: 120014100009-R; Mfr_name: MURATA; Mfr_part_number: GRM188R61A226ME15D; Part_type: CAPACITORS\CERAMIC; Project: TI_MAXIE_CPB; Wattage: NA; Customs_HS_Code: 85322990; Custom_Duty: 15%; PCB Footprint: CAP0603_1; Footprint Path: Y:\MIS_DATABASE\Library\ALTIUM_TOOL\PCB_FOOTPRINTS\Altium_Footprint_Lib.PcbLib; Library Path: Y:\MIS_DATABASE\Library\ALTIUM_TOOL\SCHEMATICS_PARTS\MS_DISCRETE_Library.schlib; MECHANICAL 3D STEP FILE: CAP0603_1; Footprint Ref: CAP0603_1; Library Ref: CAP; Tolerance: 20%; Voltage: 10V; Package: 0603; Distributor_name: DIGIKEY; Distributor_part_number: 490-10476-1-ND; Height: 1.00MM; Weight: 6.3mg; Temperature: -55°C+85°C; Datasheet: Y:\MIS_DATABASE\DATASHEETS\CAPACITORS\GRM188R61A226ME15.PDF; Crtd /date: MANIRAJA/230118; Chkd/date: MANIRAJA/230118
C367 = CAP_Dup2: CAP CERAMIC 120pF 25V 10% X7R 0201; Part_type: CAPACITORS\CERAMIC; Mfr_part_number: GRM033R71E121KA01D; Mfr_name: MURATA; Mistral Part No: 120021080009-R; Custom_Duty: 15%; Customs_HS_Code: 85322990; Wattage: NA; Project: TI_AM62x SKEVM_BRD; PCB Footprint: CAP0201_0-5; Footprint Path: Y:\MIS_DATABASE\Library\ALTIUM_TOOL\PCB_FOOTPRINTS\Altium_Footprint_Lib.PcbLib; Library Path: Y:\MIS_DATABASE\Library\ALTIUM_TOOL\SCHEMATICS_PARTS\MS_DISCRETE_Library.schlib; MECHANICAL 3D STEP FILE: CAP0201_0-5; Chkd/date: ALVY/260821; Crtd /date: MANIRAJA/260821; Datasheet: Y:\MIS_DATABASE\DATASHEETS\CAPACITORS\GRM033R71E121KA01.PDF; Temperature: -55°C+125°C; Weight: 0.33mg; Height: 0.33MM; Library Ref: CAP; Distributor_part_number: 490-3173-1-ND; Distributor_name: DIGIKEY; Package: 0201; Voltage: 25V; Tolerance: 10%; Footprint Ref: CAP0201_0-5
C395 = CAP_Dup2: CAP CERAMIC 47uF 16V 10% X6S 1210; Part_type: CAPACITORS\CERAMIC; Mfr_part_number: GRM32EC81C476KE15L; Mfr_name: MURATA; Mistral Part No: 120021070001-R; Custom_Duty: 15%; Customs_HS_Code: 85322990; Wattage: NA; Project: TI_AM263X_CC; Footprint Path: Y:\MIS_DATABASE\Library\ALTIUM_TOOL\PCB_FOOTPRINTS\Altium_Footprint_Lib.PcbLib; Library Path: Y:\MIS_DATABASE\Library\ALTIUM_TOOL\SCHEMATICS_PARTS\MS_DISCRETE_Library.schlib; MECHANICAL 3D STEP FILE: CAP1210_2-75; Chkd/date: ALVY/010721; Crtd /date: MANIRAJA/010721; Datasheet: Y:\MIS_DATABASE\DATASHEETS\CAPACITORS\GRM32EC81C476KE15.PDF; Temperature: -55°C+105°C; Weight: 100mg; Height: 2.70MM; Library Ref: CAP; Distributor_part_number: 490-10531-1-ND; Distributor_name: DIGIKEY; Package: 1210; Voltage: 16V; Tolerance: 10%; Footprint Ref: CAP1210_2-75; PCB Footprint: CAP1210_2-75
C396 C418 = CAP_Dup2: as C398 on sheet 09; Footprint Ref: CAP0805_1-5; Tolerance: 10%; Voltage: 100V; Package: 0805; Distributor_name: DIGIKEY; Distributor_part_number: 490-14464-1-ND; Library Ref: CAP; Height: 1.45MM; Weight: 6.4mg; Temperature: -55°C+125°C; Datasheet: Y:\MIS_DATABASE\DATASHEETS\CAPACITORS\GRM21BC72A105KE01.PDF; Crtd /date: ALVY/150921; Chkd/date: MANIRAJA/160921; MECHANICAL 3D STEP FILE: CAP0805_1-5; Library Path: Y:\MIS_DATABASE\Library\ALTIUM_TOOL\SCHEMATICS_PARTS\MS_DISCRETE_Library.schlib; Footprint Path: Y:\MIS_DATABASE\Library\ALTIUM_TOOL\PCB_FOOTPRINTS\Altium_Footprint_Lib.PcbLib; PCB Footprint: CAP0805_1-5
C400 = CAP_Dup2: as C150 on sheet 09; Footprint Ref: CAP0603_1; Tolerance: 20%; Voltage: 35V; Package: 0603; Distributor_name: DIGIKEY; Distributor_part_number: 490-13248-1-ND; Library Ref: CAP; Height: 1.00MM; Weight: 9mg; Temperature: -55°C+85°C; Datasheet: Y:\MIS_DATABASE\DATASHEETS\CAPACITORS\GRM188R6YA106MA73.PDF; Crtd /date: ALVY/160519; Chkd/date: MANIRAJA/170519; MECHANICAL 3D STEP FILE: CAP0603_1; Library Path: Y:\MIS_DATABASE\Library\ALTIUM_TOOL\SCHEMATICS_PARTS\MS_DISCRETE_Library.schlib; Footprint Path: Y:\MIS_DATABASE\Library\ALTIUM_TOOL\PCB_FOOTPRINTS\Altium_Footprint_Lib.PcbLib; PCB Footprint: CAP0603_1
C402 = CAP_Dup2: CAP CERAMIC 36pF 50V 2% HI-Q C0G(NP0) 0402; Mistral Part No: 120021100002-R; Mfr_name: MURATA; Mfr_part_number: GJM1555C1H360GB01D; Part_type: CAPACITORS\CERAMIC; Project: TI_AM62x SKEVM_BRD; Wattage: NA; Customs_HS_Code: 85322990; Custom_Duty: 15%; Footprint Ref: CAP0402_0-75; Tolerance: 2%; Voltage: 50V; Package: 0402; Distributor_name: DIGIKEY; Distributor_part_number: 490-GJM1555C1H360GB01DTR-ND; Library Ref: CAP; Height: 0.55MM; Weight: 1.5mg; Temperature: -55°C+125°C; Datasheet: Y:\MIS_DATABASE\DATASHEETS\CAPACITORS\GJM1555C1H360GB01.PDF; Crtd /date: ALVY/051021; Chkd/date: MANIRAJA/061021; MECHANICAL 3D STEP FILE: CAP0402_0-75; Library Path: Y:\MIS_DATABASE\Library\ALTIUM_TOOL\SCHEMATICS_PARTS\MS_DISCRETE_Library.schlib; Footprint Path: Y:\MIS_DATABASE\Library\ALTIUM_TOOL\PCB_FOOTPRINTS\Altium_Footprint_Lib.PcbLib; PCB Footprint: CAP0402_0-75
C413 = CAP_Dup2: as C153 on sheet 09; Footprint Path: Y:\MIS_DATABASE\Library\ALTIUM_TOOL\PCB_FOOTPRINTS\Altium_Footprint_Lib.PcbLib; Library Path: Y:\MIS_DATABASE\Library\ALTIUM_TOOL\SCHEMATICS_PARTS\MS_DISCRETE_Library.schlib; MECHANICAL 3D STEP FILE: CAP0402_0-75; Chkd/date: MANIRAJA/261020; Crtd /date: ALVY/211020; Datasheet: Y:\MIS_DATABASE\DATASHEETS\CAPACITORS\GRM155R71H104KE14.PDF; Temperature: -55°C+125°C; Weight: 3.1mg; Height: 0.55MM; Library Ref: CAP; Distributor_part_number: 490-10700-1-ND; Distributor_name: DIGIKEY; Package: 0402; Voltage: 50V; Tolerance: 10%; Footprint Ref: CAP0402_0-75; PCB Footprint: CAP0402_0-75
C414 = CAP_Dup2: as C141 on sheet 09; Footprint Path: Y:\MIS_DATABASE\Library\ALTIUM_TOOL\PCB_FOOTPRINTS\Altium_Footprint_Lib.PcbLib; Library Path: Y:\MIS_DATABASE\Library\ALTIUM_TOOL\SCHEMATICS_PARTS\MS_DISCRETE_Library.schlib; MECHANICAL 3D STEP FILE: CAP0603_1; Chkd/date: MANIRAJA/170519; Crtd /date: ALVY/160519; Datasheet: Y:\MIS_DATABASE\DATASHEETS\CAPACITORS\GRM188R6YA106MA73.PDF; Temperature: -55°C+85°C; Weight: 9mg; Height: 1.00MM; Library Ref: CAP; Distributor_part_number: 490-13248-1-ND; Distributor_name: DIGIKEY; Package: 0603; Voltage: 35V; Tolerance: 20%; Footprint Ref: CAP0603_1; PCB Footprint: CAP0603_1
C426 = CAP_Dup2: as C139 on sheet 09; Footprint Ref: CAP0402_0-75; Tolerance: 10%; Voltage: 50V; Package: 0402; Distributor_name: DIGIKEY; Distributor_part_number: 490-10700-1-ND; Library Ref: CAP; Height: 0.55MM; Weight: 3.1mg; Temperature: -55°C+125°C; Datasheet: Y:\MIS_DATABASE\DATASHEETS\CAPACITORS\GRM155R71H104KE14.PDF; Crtd /date: ALVY/211020; Chkd/date: MANIRAJA/261020; MECHANICAL 3D STEP FILE: CAP0402_0-75; Library Path: Y:\MIS_DATABASE\Library\ALTIUM_TOOL\SCHEMATICS_PARTS\MS_DISCRETE_Library.schlib; Footprint Path: Y:\MIS_DATABASE\Library\ALTIUM_TOOL\PCB_FOOTPRINTS\Altium_Footprint_Lib.PcbLib; PCB Footprint: CAP0402_0-75
L11 = INDUCTOR: IND CHIP 0.47uH 4.5A 20% 0806; Mfr_part_number: DFE201612E-R47M=P2; Mfr_name: MURATA; Mistral Part No: 130020100030-R; Custom_Duty: 24%; Customs_HS_Code: 85437099; Wattage: NA; Project: AM64X_SKEVM; PCB Footprint: IND0806_1-2; Footprint Path: Y:\MIS_DATABASE\Library\ALTIUM_TOOL\PCB_FOOTPRINTS\Altium_Footprint_Lib.PcbLib; Library Path: Y:\MIS_DATABASE\Library\ALTIUM_TOOL\SCHEMATICS_PARTS\MS_DISCRETE_Library.schlib; MECHANICAL 3D STEP FILE: IND0806_1-2; Chkd/date: MANIRAJA/121020; Crtd /date: ALVY/121020; Datasheet: Y:\MIS_DATABASE\DATASHEETS\DISCRETES\INDUCTORS\DFE201612E.PDF; Temperature: -40°C+125°C; Weight: 18.8mg; Height: 1.20MM; Library Ref: INDUCTOR; Distributor_part_number: DFE201612E-R47M=P2-ND; Distributor_name: DIGIKEY; Package: 0806; Voltage: NA; Tolerance: 20%; Part_type: INDUCTOR; Footprint Ref: IND0806_1-2
L12 = INDUCTOR_Dup1: IND POWER 4.7uH 11A 20% SMD; Mistral Part No: 130015090013-R; Mfr_name: COILCRAFT; Mfr_part_number: XAL6060-472MEB; Project: OCTBTS_3000; Voltage: NA; Customs_HS_Code: 85412900; Custom_Duty: 15%; Footprint Ref: IND_XAL6060_260X270_SMD_6-1; Part_type: INDUCTOR; Tolerance: 20%; Wattage: NA; Package: SMD; Distributor_name: MOUSER; Distributor_part_number: 994-XAL6060-472MEB; Library Ref: INDUCTOR; Height: 6.10MM; Weight: 1600g; Temperature: -40°C+125°C; Datasheet: Y:\MIS_DATABASE\DATASHEETS\DISCRETES\INDUCTORS\XAL6060-SER.PDF; Crtd /date: MANIRAJA/090317; Chkd/date: VASANTHA/090317; MECHANICAL 3D STEP FILE: IND_XAL6060_260X270_SMD_6-1; Library Path: Y:\MIS_DATABASE\Library\ALTIUM_TOOL\SCHEMATICS_PARTS\MS_DISCRETE_Library.schlib; Footprint Path: Y:\MIS_DATABASE\Library\ALTIUM_TOOL\PCB_FOOTPRINTS\Altium_Footprint_Lib.PcbLib; PCB Footprint: IND_XAL6060_260X270_SMD_6-1
R36 = RESISTOR_Dup6: as R468 on sheet 09; Footprint Ref: RES0201_0-5; Tolerance: 5%; Wattage: 1/20W; Package: 0201; Distributor_name: DIGIKEY; Distributor_part_number: 311-0.0NCT-ND; Library Ref: RESISTOR; Height: 0.26MM; Weight: 0.17mg; Temperature: -55°C+125°C; Datasheet: Y:\MIS_DATABASE\DATASHEETS\RESISTORS\RCXXXXL-SER_MAR18.PDF; Crtd /date: MUDDU/120710; Chkd/date: NAVEED/301214; MECHANICAL 3D STEP FILE: RES0201_0-5; Library Path: Y:\MIS_DATABASE\Library\ALTIUM_TOOL\SCHEMATICS_PARTS\MS_DISCRETE_Library.schlib; Footprint Path: Y:\MIS_DATABASE\Library\ALTIUM_TOOL\PCB_FOOTPRINTS\Altium_Footprint_Lib.PcbLib; PCB Footprint: RES0201_0-5
R104 = RESISTOR_Dup6: as R177 on sheet 09; MECHANICAL 3D STEP FILE: RES0201_0-5; Chkd/date: MANIRAJA/050517; Crtd /date: MANIRAJA/050517; Datasheet: Y:\MIS_DATABASE\DATASHEETS\RESISTORS\RCXXXXL-SER_MAR18.PDF; Temperature: -55°C+125°C; Weight: 0.17mg; Height: 0.26MM; Distributor_part_number: 311-10KNCT-ND; Distributor_name: DIGIKEY; Package: 0201; Wattage: 1/20W; Tolerance: 5%; Library Ref: RESISTOR; Footprint Ref: RES0201_0-5; Library Path: Y:\MIS_DATABASE\Library\ALTIUM_TOOL\SCHEMATICS_PARTS\MS_DISCRETE_Library.schlib; Footprint Path: Y:\MIS_DATABASE\Library\ALTIUM_TOOL\PCB_FOOTPRINTS\Altium_Footprint_Lib.PcbLib; PCB Footprint: RES0201_0-5
R105 R116 R410 = RESISTOR_Dup6: as R157 on sheet 09; Footprint Path: Y:\MIS_DATABASE\Library\ALTIUM_TOOL\PCB_FOOTPRINTS\Altium_Footprint_Lib.PcbLib; Library Path: Y:\MIS_DATABASE\Library\ALTIUM_TOOL\SCHEMATICS_PARTS\MS_DISCRETE_Library.schlib; MECHANICAL 3D STEP FILE: RES0201_0-5; Chkd/date: NAVEED/301214; Crtd /date: MUDDU/120710; Datasheet: Y:\MIS_DATABASE\DATASHEETS\RESISTORS\RCXXXXL-SER_MAR18.PDF; Temperature: -55°C+125°C; Weight: 0.17mg; Height: 0.26MM; Library Ref: RESISTOR; Distributor_part_number: 311-0.0NCT-ND; Distributor_name: DIGIKEY; Package: 0201; Wattage: 1/20W; Tolerance: 5%; Footprint Ref: RES0201_0-5; PCB Footprint: RES0201_0-5
R406 = RESISTOR: RES 100K 1/10W 1% 0402; Part_type: RESISTORS\FIXED; Mfr_part_number: ERJ-2RKF1003X; Mfr_name: PANASONIC-ECG; Mistral Part No: 110009030187-R; Custom_Duty: 15%; Customs_HS_Code: 85332119; Voltage: NA; Project: J32; PCB Footprint: RES0402_0-5; Footprint Path: Y:\MIS_DATABASE\Library\ALTIUM_TOOL\PCB_FOOTPRINTS\Altium_Footprint_Lib.PcbLib; Library Path: Y:\MIS_DATABASE\Library\ALTIUM_TOOL\SCHEMATICS_PARTS\MS_DISCRETE_Library.schlib; MECHANICAL 3D STEP FILE: RES0402_0-5; Footprint Ref: RES0402_0-5; Library Ref: RESISTOR; Chkd/date: VASANTHA/201216; Crtd /date: MAZHAR/130306; Datasheet: Y:\MIS_DATABASE\DATASHEETS\RESISTORS\PAN-ERJSER_NOV17.PDF; Temperature: -55°C+155°C; Weight: 0.8mg; Height: 0.40MM; Distributor_part_number: P100KLCT-ND; Distributor_name: DIGIKEY; Package: 0402; Wattage: 1/10W; Tolerance: 1%
R411 R453 = RESISTOR_Dup6: as R471 on sheet 09; PCB Footprint: RES0402_0-5; Footprint Path: Y:\MIS_DATABASE\Library\ALTIUM_TOOL\PCB_FOOTPRINTS\Altium_Footprint_Lib.PcbLib; Library Path: Y:\MIS_DATABASE\Library\ALTIUM_TOOL\SCHEMATICS_PARTS\MS_DISCRETE_Library.schlib; Footprint Ref: RES0402_0-5; Library Ref: RESISTOR; MECHANICAL 3D STEP FILE: RES0402_0-5; Chkd/date: VASANTHA/201216; Crtd /date: MAZHAR/130306; Datasheet: Y:\MIS_DATABASE\DATASHEETS\RESISTORS\PAN-ERJSER_NOV17.PDF; Temperature: -55°C+155°C; Weight: 0.8mg; Height: 0.40MM; Distributor_part_number: P100KLCT-ND; Distributor_name: DIGIKEY; Package: 0402; Wattage: 1/10W; Tolerance: 1%
R412 = RESISTOR_Dup6: RES 316K 1/10W 1% 0402; Part_type: RESISTORS\FIXED; Mfr_part_number: ERJ-2RKF3163X; Mfr_name: PANASONIC-ECG; Mistral Part No: 110010030027-R; Custom_Duty: 15%; Customs_HS_Code: 85332119; Voltage: NA; Project: VME_DSP_SUITE; PCB Footprint: RES0402_0-5; Chkd/date: MAZHAR/110310; Crtd /date: MUDDU/080310; Datasheet: Y:\MIS_DATABASE\DATASHEETS\RESISTORS\PAN-ERJSER_NOV17.PDF; Temperature: -55°C+155°C; Weight: 0.8mg; Height: 0.40MM; Distributor_part_number: P316KLCT-ND; Distributor_name: DIGIKEY; Package: 0402; Wattage: 1/10W; Tolerance: 1%; MECHANICAL 3D STEP FILE: RES0402_0-5; Library Ref: RESISTOR; Footprint Ref: RES0402_0-5; Library Path: Y:\MIS_DATABASE\Library\ALTIUM_TOOL\SCHEMATICS_PARTS\MS_DISCRETE_Library.schlib; Footprint Path: Y:\MIS_DATABASE\Library\ALTIUM_TOOL\PCB_FOOTPRINTS\Altium_Footprint_Lib.PcbLib
R454 = RESISTOR_Dup6: RES 32.4K 1/16W 1% 0402; Mistral Part No: 110020040003-R; Mfr_name: VISHAY; Mfr_part_number: CRCW040232K4FKED; Part_type: RESISTORS\FIXED; Project: HSDTRS_FEE_BRD; Voltage: NA; Customs_HS_Code: 85332119; Custom_Duty: 15%; Footprint Ref: RES0402_0-5; Tolerance: 1%; Wattage: 1/16W; Package: 0402; Distributor_name: DIGIKEY; Distributor_part_number: 541-32.4KLCT-ND; Library Ref: RESISTOR; Height: 0.40MM; Weight: 0.65mg; Temperature: -55°C+155°C; Datasheet: Y:\MIS_DATABASE\DATASHEETS\RESISTORS\CRCW0603.PDF; Crtd /date: ALVY/080420; Chkd/date: MANIRAJA/080420; MECHANICAL 3D STEP FILE: RES0402_0-5; Library Path: Y:\MIS_DATABASE\Library\ALTIUM_TOOL\SCHEMATICS_PARTS\MS_DISCRETE_Library.schlib; Footprint Path: Y:\MIS_DATABASE\Library\ALTIUM_TOOL\PCB_FOOTPRINTS\Altium_Footprint_Lib.PcbLib; PCB Footprint: RES0402_0-5
R455 = RESISTOR_Dup6: as R465 on sheet 09; Footprint Ref: RES0402_0-5; Tolerance: 1%; Wattage: 1/10W; Package: 0402; Distributor_name: DIGIKEY; Distributor_part_number: P100KLCT-ND; Library Ref: RESISTOR; Height: 0.40MM; Weight: 0.8mg; Temperature: -55°C+155°C; Datasheet: Y:\MIS_DATABASE\DATASHEETS\RESISTORS\PAN-ERJSER_NOV17.PDF; Crtd /date: MAZHAR/130306; Chkd/date: VASANTHA/201216; MECHANICAL 3D STEP FILE: RES0402_0-5; Library Path: Y:\MIS_DATABASE\Library\ALTIUM_TOOL\SCHEMATICS_PARTS\MS_DISCRETE_Library.schlib; Footprint Path: Y:\MIS_DATABASE\Library\ALTIUM_TOOL\PCB_FOOTPRINTS\Altium_Footprint_Lib.PcbLib; PCB Footprint: RES0402_0-5
R461 = RESISTOR_Dup6: as R494 on sheet 09; Footprint Path: Y:\MIS_DATABASE\Library\ALTIUM_TOOL\PCB_FOOTPRINTS\Altium_Footprint_Lib.PcbLib; Library Path: Y:\MIS_DATABASE\Library\ALTIUM_TOOL\SCHEMATICS_PARTS\MS_DISCRETE_Library.schlib; MECHANICAL 3D STEP FILE: RES0402_0-5; Chkd/date: VASANTHA/281216; Crtd /date: MAZHAR/150506; Datasheet: Y:\MIS_DATABASE\DATASHEETS\RESISTORS\PAN-ERJSER_NOV17.PDF; Temperature: -55°C+155°C; Weight: 0.8mg; Height: 0.40MM; Library Ref: RESISTOR; Distributor_part_number: P1.00KLCT-ND; Distributor_name: DIGIKEY; Package: 0402; Wattage: 1/10W; Tolerance: 1%; Footprint Ref: RES0402_0-5; PCB Footprint: RES0402_0-5
R467 = RESISTOR_Dup6: RES 43.2K 1/16W 1% 0402; Mistral Part No: 110021080019-R; Mfr_name: VISHAY; Mfr_part_number: CRCW040243K2FKED; Part_type: RESISTORS\FIXED; Project: TI_AM62x SKEVM_BRD; Voltage: NA; Customs_HS_Code: 85332119; Custom_Duty: 15%; Footprint Ref: RES0402_0-5; Tolerance: 1%; Wattage: 1/16W; Package: 0402; Distributor_name: DIGIKEY; Distributor_part_number: 541-43.2KLCT-ND; Library Ref: RESISTOR; Height: 0.40MM; Weight: 0.65mg; Temperature: -55°C+155°C; Datasheet: Y:\MIS_DATABASE\DATASHEETS\RESISTORS\CRCW0603.PDF; Crtd /date: ALVY/250821; Chkd/date: MANIRAJA/250821; MECHANICAL 3D STEP FILE: RES0402_0-5; Library Path: Y:\MIS_DATABASE\Library\ALTIUM_TOOL\SCHEMATICS_PARTS\MS_DISCRETE_Library.schlib; Footprint Path: Y:\MIS_DATABASE\Library\ALTIUM_TOOL\PCB_FOOTPRINTS\Altium_Footprint_Lib.PcbLib; PCB Footprint: RES0402_0-5
TP10 TP31 TP51 = TESTPOINT: as TP70 on sheet 10; Customs_HS_Code: NA; RoHS: NA; Footprint Ref: TP20_SMD; Library Ref: TESTPOINT; Mistral Part No: NA; Mfr_part_number: TP20_SMD; Part_type: TESTPOINT; Package: SMD; Distributor_name: NA; Distributor_part_number: NA; Height: NA; Crtd /date: MAZHAR/171006; Chkd/date: SHREESHAIL/171006; Tolerance: NA; Voltage: NA; Wattage: NA; Weight: NA; Temperature: NA; Datasheet: NA; MECHANICAL 3D STEP FILE: NA; Library Path: Y:\MIS_DATABASE\Library\ALTIUM_TOOL\SCHEMATICS_PARTS\MS_DISCRETE_Library.schlib; Footprint Path: Y:\MIS_DATABASE\Library\ALTIUM_TOOL\PCB_FOOTPRINTS\Altium_Footprint_Lib.PcbLib; PCB Footprint: TP20_SMD
TP33 TP42 = TESTPOINT: as TP92 on sheet 09; Footprint Path: Y:\MIS_DATABASE\Library\ALTIUM_TOOL\PCB_FOOTPRINTS\Altium_Footprint_Lib.PcbLib; Library Path: Y:\MIS_DATABASE\Library\ALTIUM_TOOL\SCHEMATICS_PARTS\MS_DISCRETE_Library.schlib; Datasheet: NA; Temperature: NA; Weight: NA; Wattage: NA; Voltage: NA; Tolerance: NA; Chkd/date: SHREESHAIL/171006; Crtd /date: MAZHAR/171006; Height: NA; Distributor_part_number: NA; Distributor_name: NA; Package: SMD; Part_type: TESTPOINT; Mfr_part_number: TP20_SMD; Mistral Part No: NA; Library Ref: TESTPOINT; Footprint Ref: TP20_SMD; RoHS: NA; Customs_HS_Code: NA; Custom_Duty: NA; PCB Footprint: TP20_SMD
U5 = TLV71318PDQNR_X2SON4: IC 500mA 1.2V LOW IQ LDO REGULATOR X2SON-4; Part_type: ICS\POWER\VOLTAGE REGULATOR; Mfr_name: TEXAS INSTRUMENTS; Mistral Part No: 142021090022-R; Custom_Duty: 15%; Customs_HS_Code: 85423100; Wattage: NA; Project: TI_AM62x SKEVM_BRD; Footprint Path: Y:\MIS_DATABASE\Library\ALTIUM_TOOL\PCB_FOOTPRINTS\Altium_Footprint_Lib.PcbLib; Library Path: Y:\MIS_DATABASE\Library\ALTIUM_TOOL\SCHEMATICS_PARTS\MS_MISCPOWER_Library.schlib; MECHANICAL 3D STEP FILE: X2SON4_TLV71318P_40X40_0-4; Chkd/date: MANIRAJA/290921; Crtd /date: ALVY/290921; Datasheet: Y:\MIS_DATABASE\DATASHEETS\ICS\POWER\TLV755P.PDF; Temperature: -40°C+125°C; Weight: 1.1mg; Height: 0.40MM; Library Ref: TLV71318PDQNR_X2SON4; Distributor_part_number: 296-51785-1-ND; Distributor_name: DIGIKEY; Package: X2SON-4; Voltage: NA; Tolerance: NA; Mfr_part_number: TLV75512PDQNR; Footprint Ref: X2SON4_TLV71318P_40X40_0-4; PCB Footprint: X2SON4_TLV71318P_40X40_0-4
U21 = TLV71318PDQNR_X2SON4_Dup1: IC 500mA LOW IQ LDO REGULATOR X2SON-4; Part_type: ICS\POWER\VOLTAGE REGULATOR; Mfr_name: TEXAS INSTRUMENTS; Mistral Part No: 142020060013-R; Custom_Duty: 15%; Customs_HS_Code: 85423100; Wattage: NA; Project: AM64x-GP_EVM BRD; Footprint Path: Y:\MIS_DATABASE\Library\ALTIUM_TOOL\PCB_FOOTPRINTS\Altium_Footprint_Lib.PcbLib; Library Path: Y:\MIS_DATABASE\Library\ALTIUM_TOOL\SCHEMATICS_PARTS\MS_MISCPOWER_Library.schlib; MECHANICAL 3D STEP FILE: X2SON4_TLV71318P_40X40_0-4; Crtd /date: ALVY/160620; Datasheet: Y:\MIS_DATABASE\DATASHEETS\ICS\POWER\TLV755P.PDF; Temperature: -40°C+125°C; Weight: 1.1mg; Height: 0.40MM; Library Ref: TLV71318PDQNR_X2SON4; Distributor_part_number: 296-51790-1-ND; Distributor_name: DIGIKEY; Package: X2SON-4; Voltage: NA; Tolerance: NA; Mfr_part_number: TLV75518PDQNR; Footprint Ref: X2SON4_TLV71318P_40X40_0-4; PCB Footprint: X2SON4_TLV71318P_40X40_0-4
U24 = TLV71318PDQNR_X2SON4: IC 500mA 1V LOW IQ LDO REGULATOR X2SON-4; Mistral Part No: 142021080018-R; Mfr_name: TEXAS INSTRUMENTS; Part_type: ICS\POWER\VOLTAGE REGULATOR; Project: TI_AM62x SKEVM_BRD; Tolerance: NA; Customs_HS_Code: 85423100; Custom_Duty: 15%; Footprint Ref: X2SON4_TLV71318P_40X40_0-4; Mfr_part_number: TLV75510PDQNR; Voltage: NA; Wattage: NA; Package: X2SON-4; Distributor_name: DIGIKEY; Distributor_part_number: 296-51782-1-ND; Library Ref: TLV71318PDQNR_X2SON4; Height: 0.40MM; Weight: 1.1mg; Temperature: -40°C+125°C; Datasheet: Y:\MIS_DATABASE\DATASHEETS\ICS\POWER\TLV755P.PDF; Crtd /date: ALVY/240821; Chkd/date: MANIRAJA/240821; MECHANICAL 3D STEP FILE: X2SON4_TLV71318P_40X40_0-4; Library Path: Y:\MIS_DATABASE\Library\ALTIUM_TOOL\SCHEMATICS_PARTS\MS_MISCPOWER_Library.schlib; Footprint Path: Y:\MIS_DATABASE\Library\ALTIUM_TOOL\PCB_FOOTPRINTS\Altium_Footprint_Lib.PcbLib; PCB Footprint: X2SON4_TLV71318P_40X40_0-4
U56 = TPS62827DMQR_VSONHR6: IC 1A ADJ STEP-DOWN CONVERTER WITH 1% OUTPUT ACCURACY VSON-HR6; Mistral Part No: 142021100006-R; Mfr_name: TEXAS INSTRUMENTS; Part_type: ICS\POWER\DC-DC CONVERTER; Project: TI_AM62x SKEVM_BRD; Tolerance: NA; Customs_HS_Code: 85423100; Custom_Duty: 15%; PCB Footprint: VSONHR6_TPS62826_60X60_1; Footprint Ref: VSONHR6_TPS62826_60X60_1; Mfr_part_number: TPS62824DMQR; Voltage: NA; Wattage: NA; Package: VSON-HR6; Distributor_name: NA; Distributor_part_number: NA; Library Ref: TPS62827DMQR_VSONHR6; Height: 1.00MM; Weight: NA; Temperature: -40°C+125°C; Datasheet: Y:\MIS_DATABASE\DATASHEETS\ICS\POWER\TPS6282XX-DEC2020.PDF; Crtd /date: MANIRAJA/071021; Chkd/date: ALVY/071021; MECHANICAL 3D STEP FILE: VSONHR6_TPS62826_60X60_1; Library Path: Y:\MIS_DATABASE\Library\ALTIUM_TOOL\SCHEMATICS_PARTS\MS_MISCPOWER_Library.schlib; Footprint Path: Y:\MIS_DATABASE\Library\ALTIUM_TOOL\PCB_FOOTPRINTS\Altium_Footprint_Lib.PcbLib
U67 = LM61460_VQFNHR14: IC 6A ADJ AUTO LOW EMI SYNCHRONOUS STEP DOWN DC-DC CONVERTER VQFN-HR14; Mistral Part No: 142021020006-R; Mfr_name: TEXAS INSTRUMENTS; Part_type: ICS\POWER\DC-DC CONVERTER; Project: J7ES_SK_BRD; Tolerance: NA; Customs_HS_Code: 85423100; Custom_Duty: 15%; Footprint Ref: VQFNHR14_LM61460_160X140_1; Mfr_part_number: LM61460AANQRJRRQ1; Voltage: NA; Wattage: NA; Package: VQFN-HR14; Distributor_name: DIGIKEY; Distributor_part_number: 296-LM61460AANQRJRRQ1TR-ND; Library Ref: LM61460_VQFNHR14; Height: 1.00MM; Weight: NA; Temperature: -40°C+150°C; Datasheet: Y:\MIS_DATABASE\DATASHEETS\ICS\POWER\LM61460-Q1.PDF; Crtd /date: MANIRAJA/030221; Chkd/date: ALVY/040221; MECHANICAL 3D STEP FILE: VQFNHR14_LM61460_160X140_1; Library Path: Y:\MIS_DATABASE\Library\ALTIUM_TOOL\SCHEMATICS_PARTS\MS_MISCPOWER_Library.schlib; Footprint Path: Y:\MIS_DATABASE\Library\ALTIUM_TOOL\PCB_FOOTPRINTS\Altium_Footprint_Lib.PcbLib; PCB Footprint: VQFNHR14_LM61460_160X140_1